# Altium schematic sheet CAN_MAIN.SchDoc
size A3; SheetNumber: 5; SheetTotal: 8
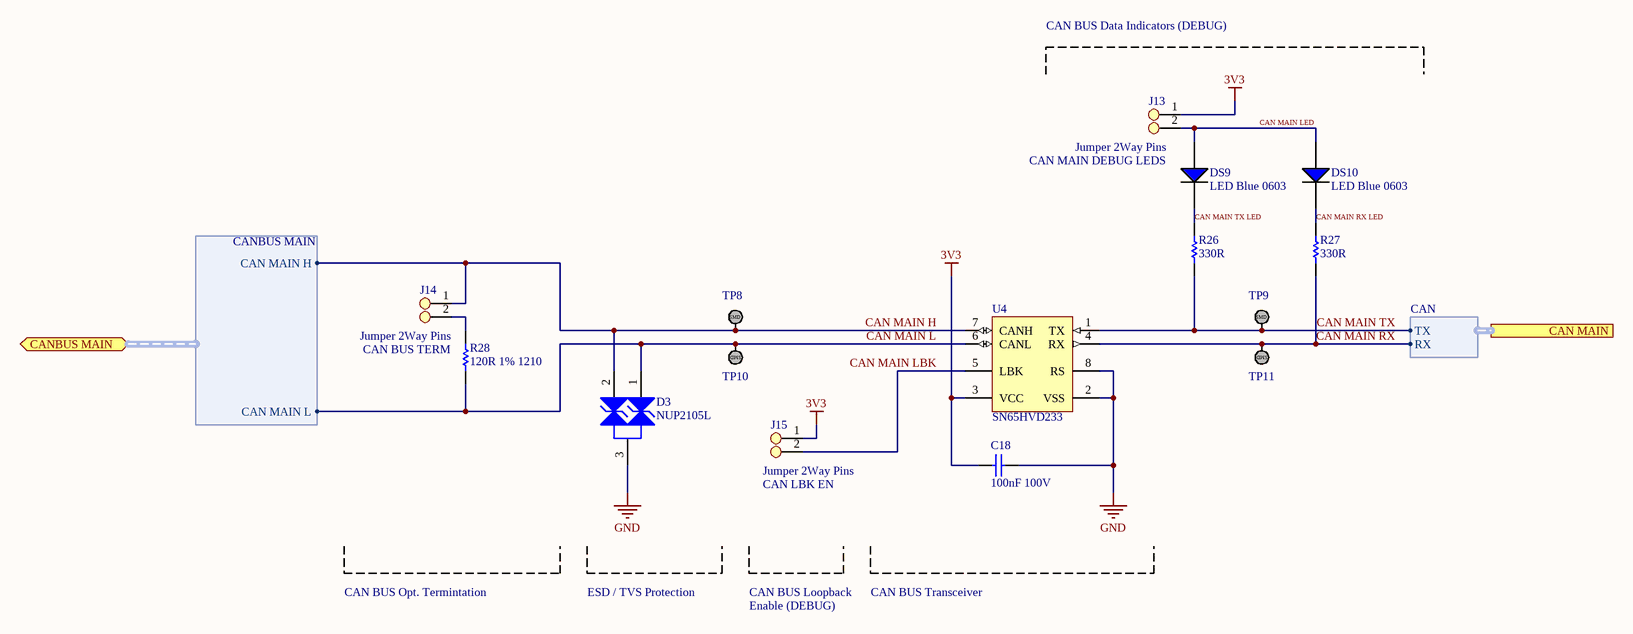
[diagram p0: CAN_MAIN.SchDoc]

## Parts
C18  100nF 100V  [Cap_Ceramic_0603]
D3  NUP2105L  [NUP2105L]
DS9  LED Blue 0603  [LED BLUE 0603]
DS10  LED Blue 0603  [LED BLUE 0603]
J13  Jumper 2Way Pins  [Jumper_2Way_Pin]
J14  Jumper 2Way Pins  [Jumper_2Way_Pin]
J15  Jumper 2Way Pins  [Jumper_2Way_Pin]
R26  330R  [Res_ThinFilm_0603]
R27  330R  [Res_ThinFilm_0603]
R28  120R 1% 1210  [Res_ThinFilm_1210]
TP8  TestPoint_SMD  [TestPointSMD]  (value not drawn)
TP9  TestPoint_SMD  [TestPointSMD]  (value not drawn)
TP10  TestPoint_SMD  [TestPointSMD]  (value not drawn)
TP11  TestPoint_SMD  [TestPointSMD]  (value not drawn)
U4  SN65HVD233  [SN65HVD233DR]

## Ports
CAN MAIN (harness CAN), CANBUS MAIN (bidir, harness CANBUS MAIN)

## Harnesses
CANBUS MAIN: CAN MAIN H, CAN MAIN L
CAN: RX, TX

## Nets
3V3: C18.2 J13.1 J15.1 U4.3(VCC)
GND: C18.1 D3.3 U4.2(VSS) U4.8(RS)
CAN MAIN H: D3.2 J14.1 TP8.1 U4.7(CANH) ; port CANBUS MAIN.CAN MAIN H
CAN MAIN L: D3.1 R28.1 TP10.1 U4.6(CANL) ; port CANBUS MAIN.CAN MAIN L
CAN MAIN LBK: J15.2 U4.5(LBK)
CAN MAIN LED: DS9.1(A) DS10.1(A) J13.2
CAN MAIN RX: R27.1 TP11.1 U4.4(RX) ; port CAN MAIN.RX
CAN MAIN RX LED: DS10.2(C) R27.2
CAN MAIN TX: R26.1 TP9.1 U4.1(TX) ; port CAN MAIN.TX
CAN MAIN TX LED: DS9.2(C) R26.2
NetJ14_2: J14.2 R28.2

## Notes on the sheet
- CAN BUS Data Indicators (DEBUG)
- CAN MAIN DEBUG LEDS
- (near R28) CAN BUS TERM
- (near J15) CAN LBK EN
- CAN BUS Opt. Termintation
- ESD / TVS Protection
- CAN BUS Loopback
- Enable (DEBUG)
- CAN BUS Transceiver
- (in symbol TestPoint_SMD) SMD

## Library data of the parts
C18 = 100nF 100V 5% X7R 0603: Capacitor, Ceramic, SMD, 100nF, 100V, 5%, X7R, 0603
J13-J15 = Jumper 2Way Side Pins
R26 R27 = 330R 5% 0603: Resistor, SMD, 330R, 0.1W, 5%, 0603
R28 = 120R 1% 1210: Resistor, SMD, 120R, 0.25W, 1%, 1210
D3 = NUP2105L: ComponentLink1Description: Datasheet; ComponentLink1URL: https://www.onsemi.cn/PowerSolutions/document/NUP2105L-D.PDF; Parameter 1: *; ComponentLink2Description: LCSC; ComponentLink2URL: https://lcsc.com/product-detail/TVS_ON-Semiconductor-NUP2105LT1G_C14486.html; ComponentLink3Description: Digikey; ComponentLink3URL: https://www.digikey.com.au/product-detail/en/on-semiconductor/SZNUP2105LT1G/SZNUP2105LT1GOSCT-ND/3487669
U4 = SN65HVD233: ComponentLink1Description: LCSC; ComponentLink1URL: https://lcsc.com/product-detail/CAN-ICs_Texas-Instruments_SN65HVD233DRG4_Texas-Instruments-Texas-Instruments-SN65HVD233DRG4_C61643.html; ComponentLink2Description: Digikey; ComponentLink2URL: https://www.digikey.com.au/product-detail/en/texas-instruments/SN65HVD233DR/296-35967-1-ND/4134960; ComponentLink3Description: Datasheet; ComponentLink3URL: https://www.ti.com/lit/ds/symlink/sn65hvd233.pdf?ts=1588560888178; ComponentLink4Description: Ti Product Page; ComponentLink4URL: https://www.ti.com/product/SN65HVD233